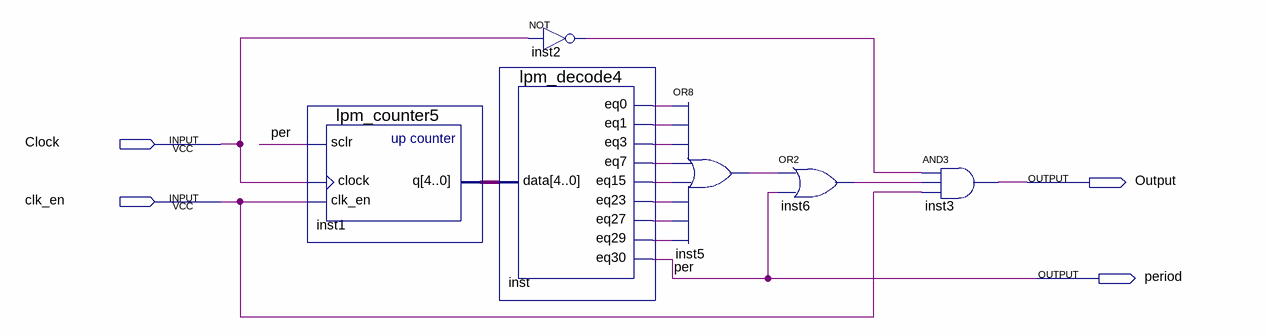
[diagram p0: schematic sheet]
// Quartus schematic dc_scheme.bdf as structural Verilog: 6 symbols, 4 pins
module dc_scheme (
  input  Clock,
  input  clk_en,
  output Output,
  output period
);

  wire inst2_out, inst5_out, inst6_out, inst_eq0, inst_eq1, inst_eq3, inst_eq7, inst_eq15, inst_eq23,
       inst_eq27, inst_eq29;
  wire [4:0] inst1_q;

  lpm_counter5 inst1 (.sclr(period), .clock(Clock), .clk_en(clk_en), .q(inst1_q));
  not inst2 (inst2_out, Clock);
  lpm_decode4 inst (
    .data(inst1_q), .eq0(inst_eq0), .eq1(inst_eq1), .eq3(inst_eq3), .eq7(inst_eq7), .eq15(inst_eq15),
    .eq23(inst_eq23), .eq27(inst_eq27), .eq29(inst_eq29), .eq30(period));
  or inst5 (inst5_out, inst_eq0, inst_eq1, inst_eq3, inst_eq7, inst_eq15, inst_eq23, inst_eq27, inst_eq29);
  or inst6 (inst6_out, inst5_out, period);
  and inst3 (Output, inst2_out, inst6_out, clk_en);

  // Other names for the same wires on the sheet: per = period
endmodule
